# EAGLE design DMP2 (EAGLE 9.6.2)
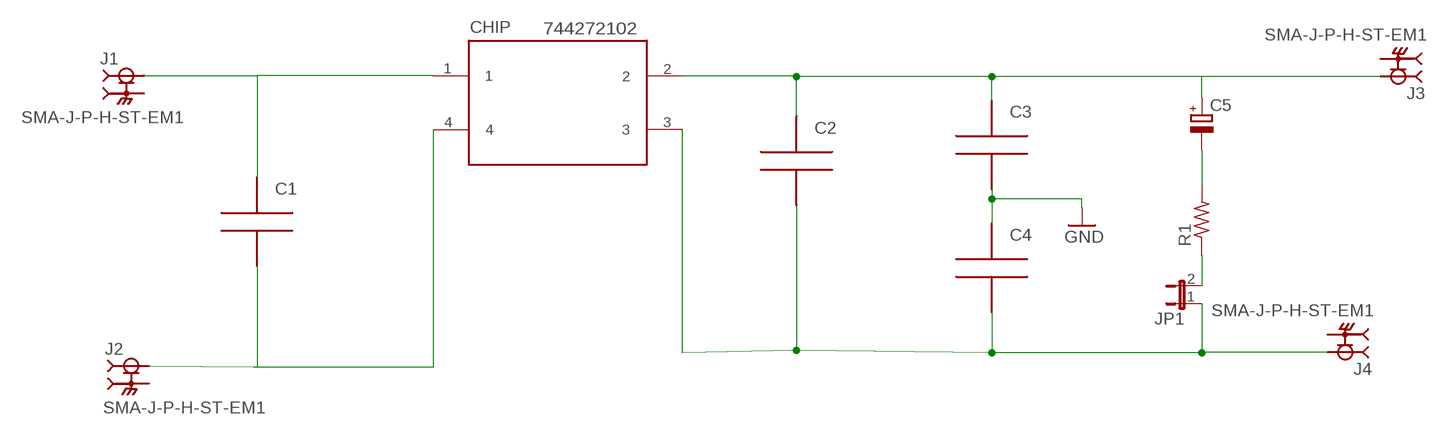
[diagram p0: schematic, sheet 1]

## Parts
C1  CAPA1206  [FGJGFN]
C2  CAPA1206  [FGJGFN]
C3  CAPA1206  [FGJGFN]
C4  CAPA1206  [FGJGFN]
C5  C-POL_ECAP-8.5MM  [CAPAE830X1050N]
CHIP  CHOKE  [CHOKE]
J1  SMA-J-P-H-ST-EM1  [SAMTEC_SMA-J-P-H-ST-EM1]
J2  SMA-J-P-H-ST-EM1  [SAMTEC_SMA-J-P-H-ST-EM1]
J3  SMA-J-P-H-ST-EM1  [SAMTEC_SMA-J-P-H-ST-EM1]
J4  SMA-J-P-H-ST-EM1  [SAMTEC_SMA-J-P-H-ST-EM1]
JP1  JP1E  [JP1]
R1  R-US_R1206  [R1206]

## Nets
GND: C3.1 C4.2
N$1: C2.2 C3.2 C5.1(+) CHIP.2 J3.1
N$2: C5.2(-) R1.2
N$3: C1.2 CHIP.1 J1.1
N$4: C2.1 C4.1 CHIP.3 J4.1 JP1.1
N$5: C1.1 CHIP.4 J2.1
N$6: JP1.2 R1.1
Unconnected: J1.2_1 J1.2_2 J1.3_1 J1.3_2 J2.2_1 J2.2_2 J2.3_1 J2.3_2 J3.2_1 J3.2_2 J3.3_1 J3.3_2 J4.2_1 J4.2_2 J4.3_1 J4.3_2

## Notes on the sheet
- C1=1500pF

## Library data of the parts
C1-C4 = capa:CAPA
C5 = Capacitor:C-POL: Capacitor Polarised - Generic; CATEGORY: Capacitor
CHIP = CHOKE:CHOKE
J1-J4 = SMA:SMA-J-P-H-ST-EM1: SMA Connector Jack, Female Socket 50Ohm Board Edge, End Launch Solder; MANUFACTURER: Samtec; MAXIMUM_PACKAGE_HEIGHT: 3.675mm; PARTREV: G; STANDARD: Manufacturer Recommendations
JP1 = jumper:JP1E: JUMPER
R1 = rcl:R-US_: RESISTOR, American symbol; SPICEPREFIX: R

## Board
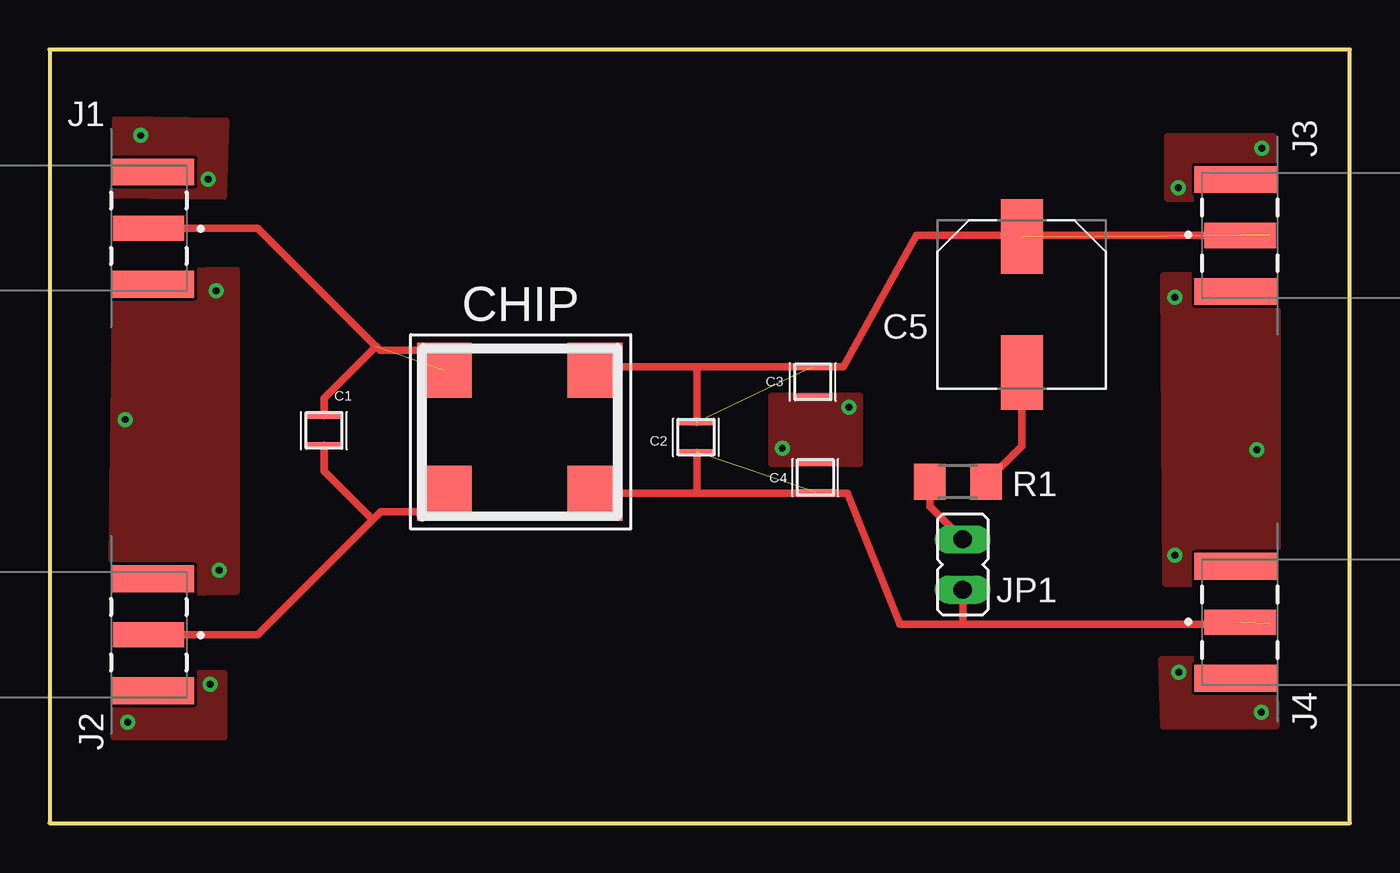
[diagram p1: board, top side]
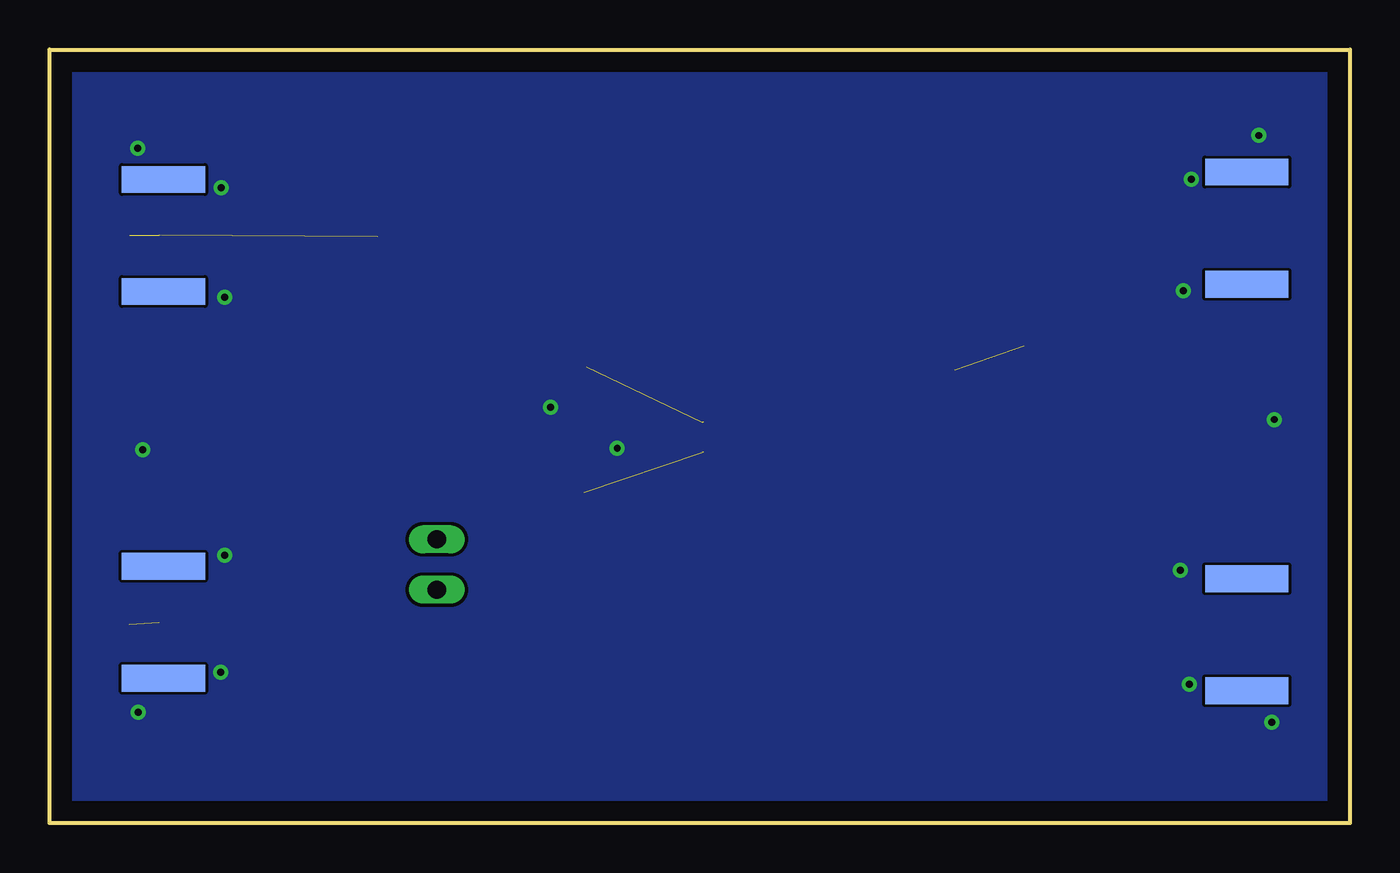
[diagram p2: board, bottom side, seen from below]

Size 65.58 x 39 mm. Coordinates in mm from the lower left corner, seen from the top.
Outline: 0,39 0,0 65.58,0 65.58,39 0,39
Copper layers (1*16): Top 0.035mm / dielectric 1.5mm / Bottom 0.035mm
Design rules "default": minimum track width 6mil, minimum drill 0.35mm, track to track 6mil, track to pad 6mil, pad to pad 6mil, via to via 6mil, smd to smd 6mil, copper to edge 40mil, drill to drill 6mil, minimum pad ring 10mil, minimum via ring 8mil, stop-mask expansion 4mil, vias tented up to drill 0mil, thermal gap 10mil

### Footprints (pad centres in the part's own frame; a part is rotated, then mirrored left to right if it is on the bottom)
FGJGFN = smd 0.3 x 1.8: 1 -0.8,0; 2 0.7,0
CAPAE830X1050N = smd 3.764 x 2.115: 1 -3.426,0; 2 3.426,0
CHOKE = smd 2.76 x 2.76: 1 -3.79,2.54; 2 3.81,2.54; 3 3.81,-3.66; 4 -3.79,-3.66
SAMTEC_SMA-J-P-H-ST-EM1 = smd 1.27 x 3.6: 1 0,0 | smd 1.35 x 4.2: 2_1 -2.825,0.2; 3_1 2.825,0.2 | smd 1.35 x 4.2 bottom: 2_2 -2.825,0.2; 3_2 2.825,0.2
JP1 = drill 0.914 long: 1 0,-1.27; 2 0,1.27
R1206 = smd 1.6 x 1.803: 1 -1.422,0; 2 1.422,0

### Placement (x,y rotation side)
C1  13.85,19.85 90 top
C2  32.61,19.51 90 top
C3  38.5,22.3 90 top
C4  38.63,17.48 90 top
C5  49.03,26.15 270 top
CHIP  23.7,20.29 0 top
J1  5,30 270 top
J2  5,9.5 270 top
J3  60.04,29.63 90 top
J4  60.04,10.13 90 top
JP1  46.05,13.04 0 top
R1  45.81,17.21 0 top

### Tracks (layer width: path | path; a pad name or v marks a point on that pad's centre or on a via)
GND  (via drill 0.35)
  other vias: 40.31,20.97 36.95,18.9 56.74,26.51 8,32.47 4.59,34.67 8.55,12.76 8.4,26.84 3.82,20.35 3.93,5.08 60.88,18.83 56.76,13.51 56.95,7.61 61.1,5.59 56.92,32.03 8.1,7.01 61.14,34.02
  pour Top (no thermals): 36.44,21.52 40.84,21.52 40.84,18.14 36.44,18.14
  pour Top (no thermals): 3.35,27.79 9.4,27.87 9.4,11.69 3.14,11.6
  pour Top (no thermals): 3.2,31.68 8.76,31.6 8.89,35.38 3.33,35.46
  pour Top (no thermals): 3.26,7.54 8.78,7.54 8.78,4.35 3.26,4.35
  pour Top (no thermals): 61.83,4.9 56.19,4.9 56.09,8.24 61.73,8.24
  pour Top: 56.4,34.6 61.7,34.6 61.7,31.5 56.4,31.5
  pour Top: 61.9,27.6 56.2,27.6 56.31,12.1 61.9,12.1
  pour Bottom: 0,39 65.6,39 65.6,0.2 0,0.2
N$1  (4 unrouted)
  Top 0.38: CHIP.2 27.68,23 32.5,23 | 32.5,23 40.04,23 43.73,29.63 61.54,29.63 | 32.66,20.21 32.66,22.84 32.5,23
N$2
  Top 0.38: R1.2 49.03,19.01 C5.2
N$3  (1 unrouted)
  Top 0.38: CHIP.1 18.91,23.83 16.67,23.83 16.46,24.04 13.84,21.41 C1.2 | 16.45,24.05 10.5,30 J1.1
N$4  (3 unrouted)
  Top 0.38: CHIP.3 32.5,16.63 | 32.5,16.63 40.23,16.63 42.88,10.04 46,10.04 | 46,10.04 61.56,10.04 | 32.66,18.71 32.66,16.79 32.5,16.63 | JP1.1 46.05,10.09 46,10.04
N$5
  Top 0.38: 16.3,15.3 10.5,9.5 J2.1 | 16.3,15.3 13.85,17.75 C1.1 | CHIP.4 19.91,15.7 16.7,15.7 16.3,15.3
N$6
  Top 0.38: JP1.2 44.39,15.97 R1.1